# EasyEDA Pro project 3轴6.1--esp32 -(7-8).eprj, board PCB
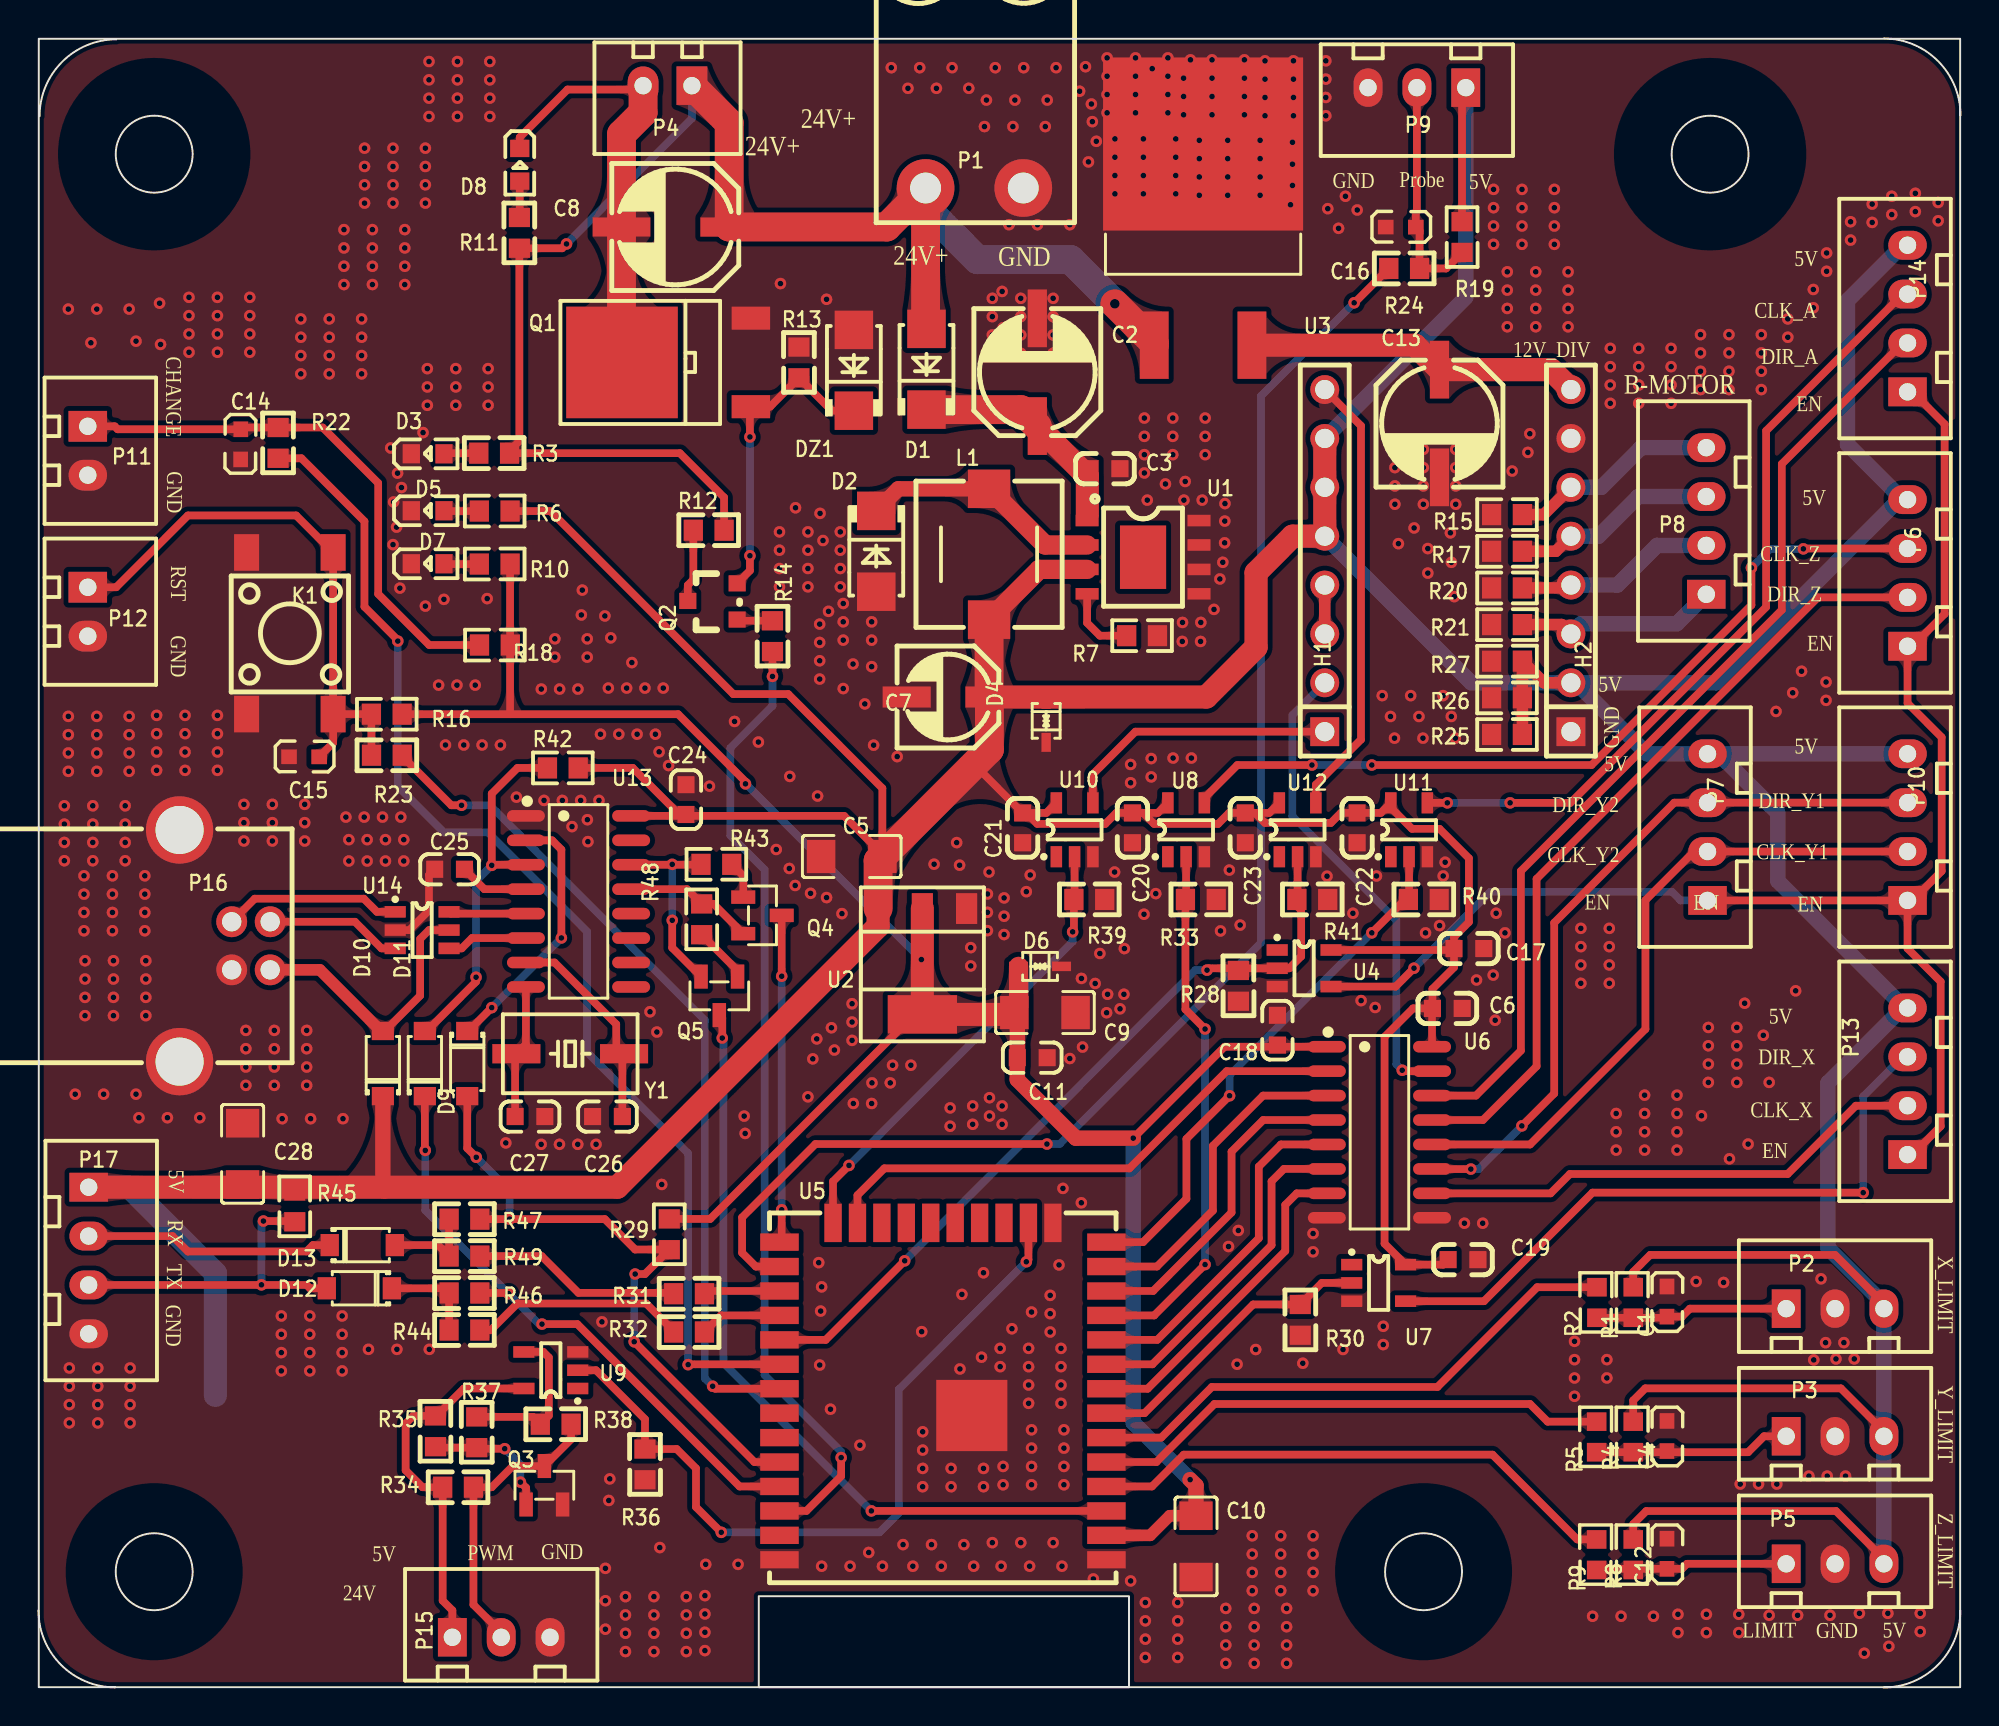
[diagram p1: board, top side]
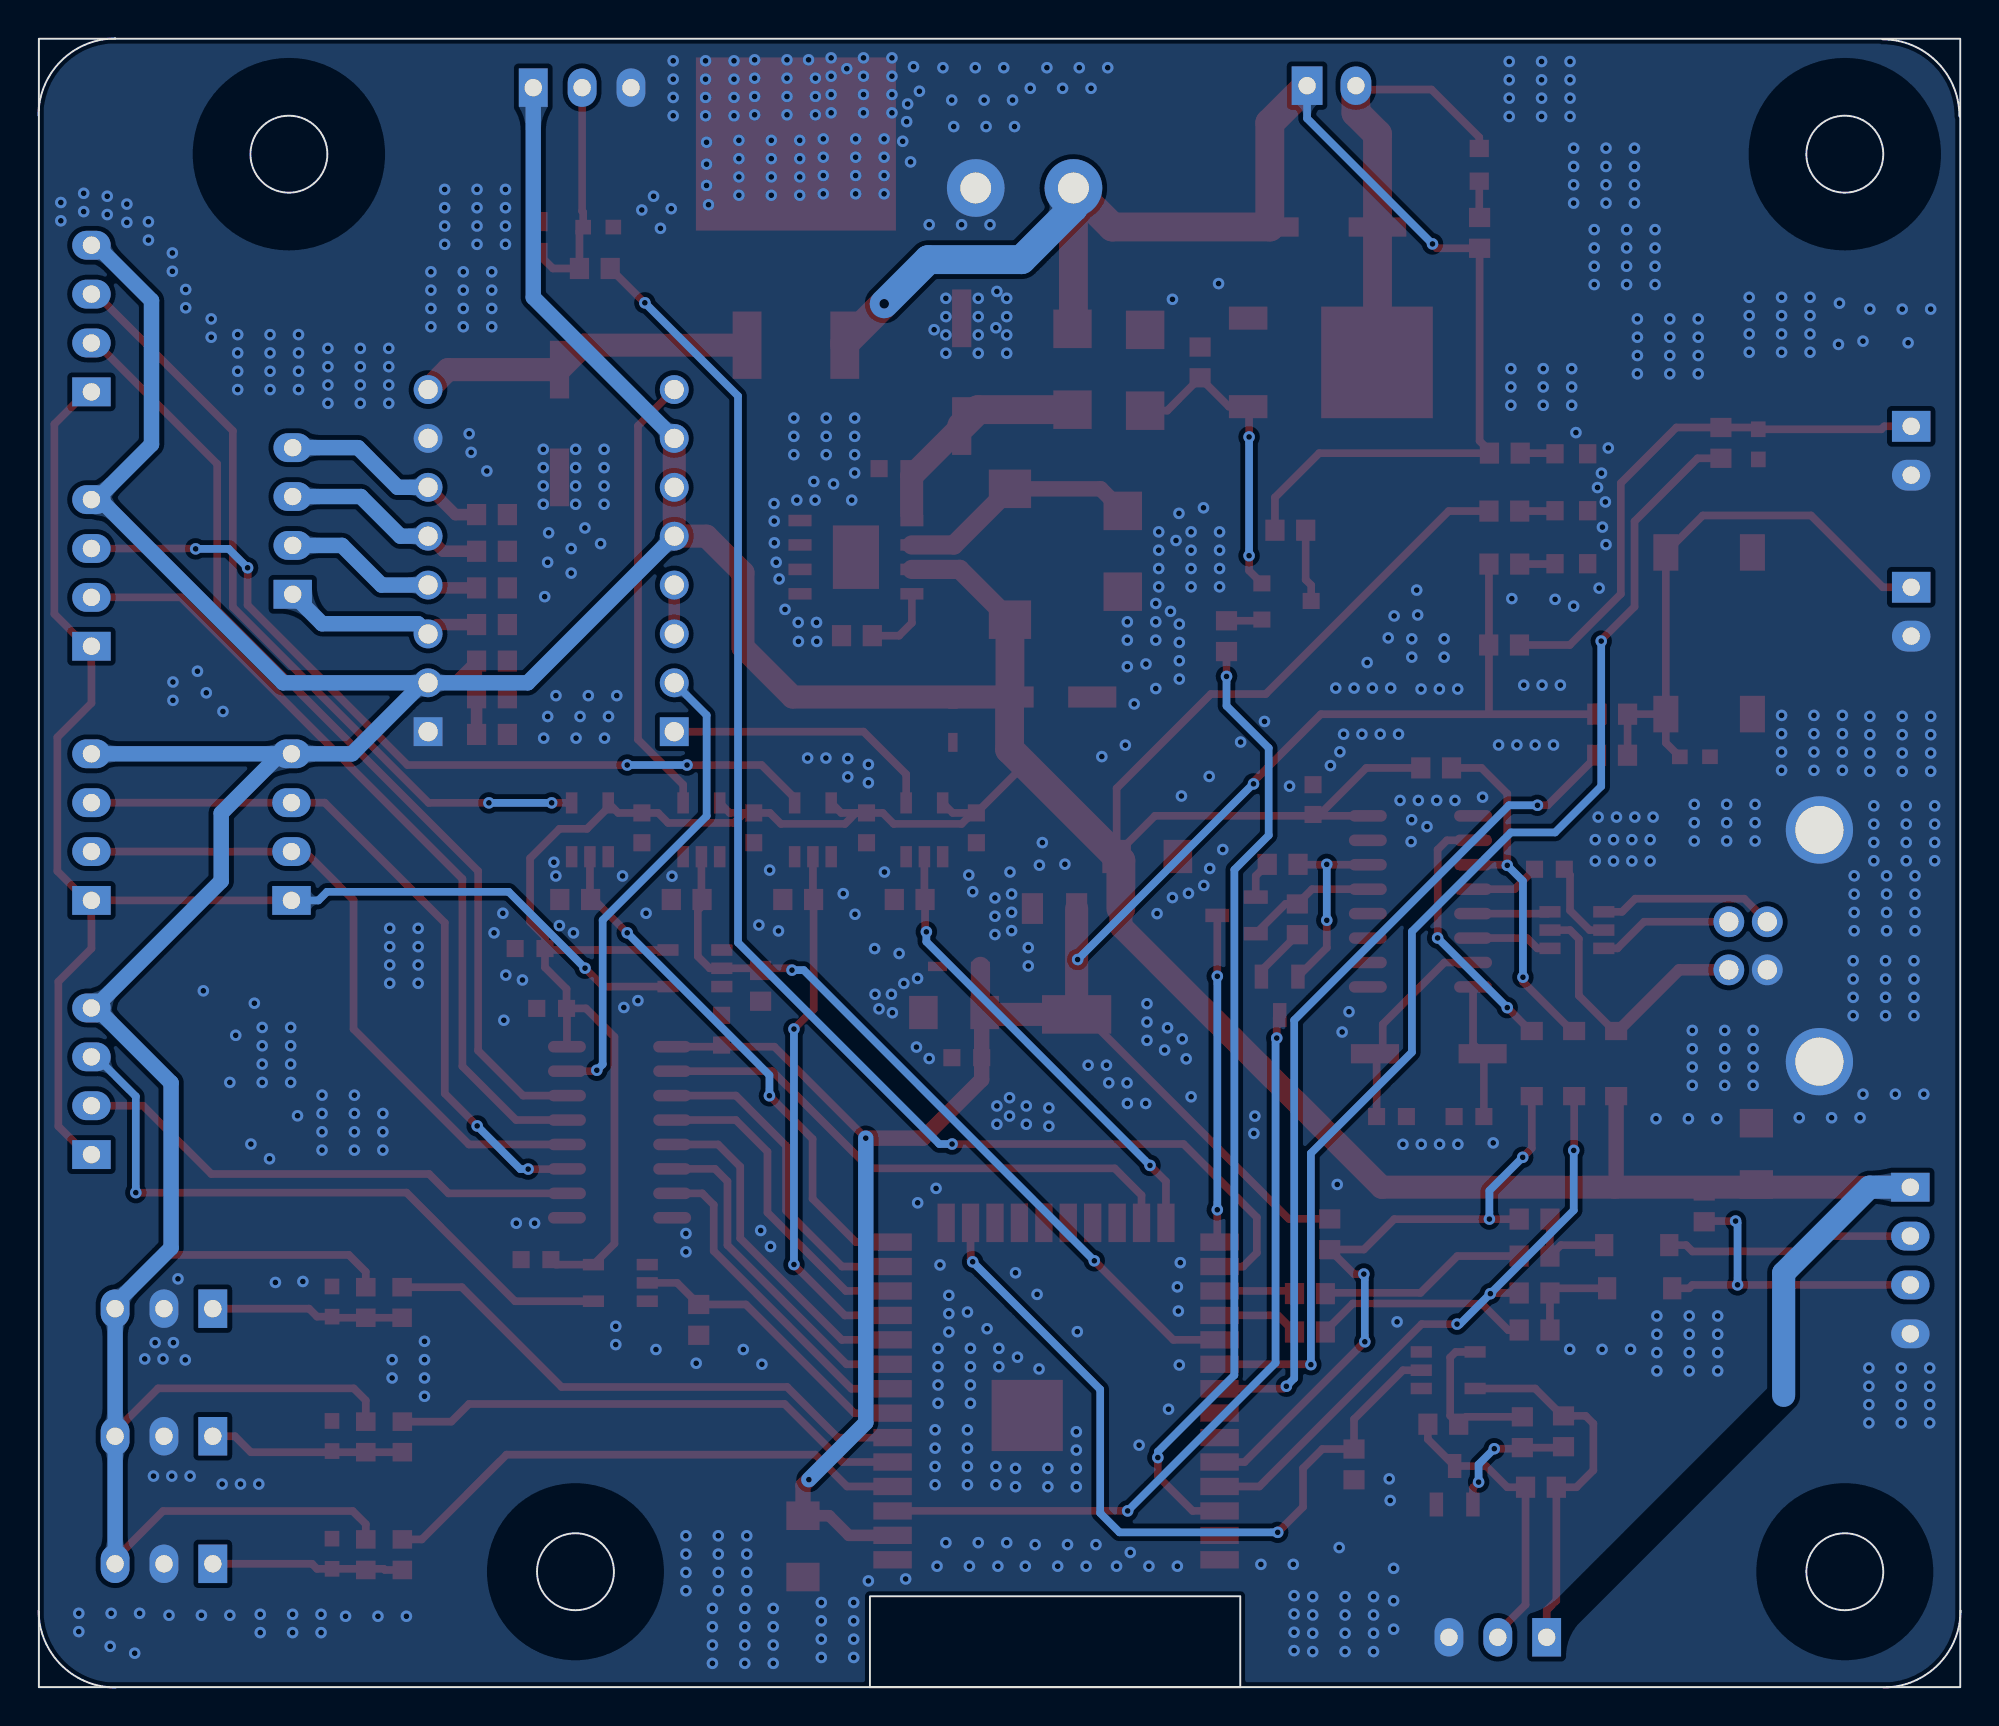
[diagram p2: board, bottom side, seen from below]

Outline 99.94 x 85.7 mm; copper layers: Top Layer, Bottom Layer. Coordinates in mm from the lower left corner of the outline.
Outline path: rectangle 0.02,85.69 99.92,0.02 ; circle c6.02,79.69 r2 ; circle c6.02,6.02 r2 ; rectangle 37.45,4.74 56.7,0.02 ; circle c72.02,6.02 r2 ; circle c86.92,79.69 r2 ; 0.06,81.66 arc(1.23,84.49) 4.06,85.66 ; 4,0.01 arc(1.17,1.18) 0,4.01 ; 95.94,85.7 arc(98.77,84.53) 99.94,81.7 ; 99.93,4 arc(98.76,1.17) 95.93,0
Stack: Top Layer 0.035mm / Dielectric1 1.51mm FR4 er 4.5 / Bottom Layer 0.035mm

## Design rules (mm)
template: 用户自定义配置
spacing Default (default): track to track 0.152, other pairs 0 to 0.152
track width Default (default): min 0.254, default 0.254, max 25.4
differential pair differentialPair (default): width min 0.127, default 0.254, max 2.54; gap min 0.152, default 0.152
via Default (default): diameter min 0.25, default 0.61, max 100.025; hole min 0.2, default 0.305, max 59.995

## Placement (name value [footprint] x y rotation side)
C1  103  [11]  84.97 20.8 90 top
C2  100uF/35V  [电解电容贴片6X6]  51.94 68.36 90 top
C3  104  [0603C]  55.45 63.34 180 top
C4  103  [11]  84.97 13.81 90 top
C5  10uF  [C1206]  42.29 43.19 180 top
C6  104  [0603C]  73.25 35.29 180 top
C7  100uF/10V  [CAP-SMD_BD5.0-L5.3-W5.3-RD]  47.3 51.48 0 top
C8  100uF/35V  [电解电容贴片6X6]  33.11 75.9 180 top
C9  4.7uF  [C1206]  52.33 35.08 180 top
C10  4.7uF  [C1206]  60.19 7.33 90 top
C11  104  [0603C]  51.67 32.73 180 top
C12  103  [11]  84.97 7.69 90 top
C13  100uF/35V(47uF/50V)  [电解电容贴片6X6]  72.85 65.69 270 top
C14  103  [11]  10.22 63.87 270 top
C15  103  [11]  13.07 48.67 180 top
C16  103  [11]  70.09 76.2 180 top
C17  104  [0603C]  74.38 38.4 180 top
C18  104  [0603C]  64.42 34.16 90 top
C19  104  [0603C]  74.07 22.24 180 top
C20  104  [0603C]  56.88 44.68 90 top
C21  104  [0603C]  51.17 44.68 90 top
C22  104  [0603C]  68.56 44.68 90 top
C23  104  [0603C]  62.75 44.68 90 top
C24  104  [0603C]  33.67 46.15 90 top
C25  104  [0603C]  21.38 42.53 180 top
C26  18pF  [0603C]  29.59 29.67 180 top
C27  18pF  [0603C]  25.56 29.67 0 top
C28  10uF  [C1206]  10.61 27.73 90 top
D1  SS56  [SMA]  46.17 68.51 90 top
D2  SS34  [SMA]  43.56 59.05 270 top
D3  绿光  [0603LED]  20.2 64.1 180 top
D4  PESD5V0L1BA-N  [SOD-323_L1.8-W1.3-LS2.5-BI]  52.39 50.24 90 top
D5  绿光  [0603LED]  20.2 61.14 180 top
D6  PESD3V3L1BA-N  [SOD-323_L1.8-W1.3-LS2.5-BI]  52.08 37.48 180 top
D7  绿光  [0603LED]  20.2 58.39 180 top
D8  绿光  [0603LED]  25.01 79.17 90 top
D9  1N4148  [SOD-123_L2.8-W1.8-LS3.7-RD]  22.29 32.43 270 top
D10  1N4148  [SOD-123_L2.8-W1.8-LS3.7-RD]  17.91 32.43 90 top
D11  1N4148  [SOD-123_L2.8-W1.8-LS3.7-RD]  20.09 32.43 90 top
D12  1N4148  [SOD-123_L2.8-W1.8-LS3.7-RD]  16.68 20.75 180 top
D13  1N4148  [SOD-123_L2.8-W1.8-LS3.7-RD]  16.84 22.99 0 top
DZ1  --ѹ------SMAZ10V  [SMA]  42.4 68.46 90 top
H1  PZ254V-11-08P  [HDR-TH_8P-P2.54-V-M]  66.88 58.57 90 top
H2  PZ254V-11-08P  [HDR-TH_8P-P2.54-V-M]  79.68 58.57 90 top
K1  SW_6X6_H=12.0MM  [KEY-SMD_4P-L6.0-W6.0-P4.50-LS9.0]  13.07 54.79 90 top
L1  68uH  [IND-SMD_L7.0-W7.0_SMDRI74-330MT]  49.43 58.9 90 top
P1  WJ2EDGR-5.08-2P  [CONN-TH_WJ2EDGR-5.08-2P]  48.67 77.93 180 top
P2  3P  [HDR1X3_CON]  93.41 19.69 0 top
P3  3P  [HDR1X3_CON]  93.41 13.06 0 top
P4  2P  [HDR1X2_CON]  32.71 83.25 180 top
P5  3P  [HDR1X3_CON]  93.41 6.43 0 top
P6  4P  [HDR1X4_CON]  97.18 54.11 90 top
P7  4P  [HDR1X4_CON]  86.78 40.91 90 top
P8  4P  [HDR1X4_CON]  86.72 56.82 90 top
P9  3P  [HDR1X3_CON]  71.67 83.15 180 top
P10  4P  [HDR1X4_CON]  97.18 40.91 90 top
P11  2P  [HDR1X2_CON]  2.57 64.28 270 top
P12  2P  [HDR1X2_CON]  2.57 55.91 270 top
P13  4P  [HDR1X4_CON]  97.18 27.7 90 top
P14  4P  [HDR1X4_CON]  97.18 67.34 90 top
P15  3P  [HDR1X3_CON]  24.06 2.61 0 top
P16  USB-B10-BRW  [USB-B-TH_USB-B10-BRW]  9.69 38.55 270 top
P17  4P  [HDR1X4_CON]  2.61 26 270 top
Q1  F50N06 (FR9024N)  [TO-252]  34.44 68.87 90 top
Q2  SS8050  [SOT-23]  36.33 55.5 90 top
Q3  SS8050  [SOT-23-3_L2.9-W1.3-P1.90-LS2.4-BR]  26.3 10.51 270 top
Q4  SS8050  [SOT-23-3_L2.9-W1.3-P1.90-LS2.4-BR]  37.64 40.13 180 top
Q5  SS8050  [SOT-23-3_L2.9-W1.3-P1.90-LS2.4-BR]  35.4 35.95 90 top
R1  20K  [10]  83.04 19.12 90 top
R2  100  [10]  81.15 19.12 90 top
R3  47K  [0603R]  23.69 64.15 0 top
R4  20K  [10]  83.04 12.13 90 top
R5  100  [10]  81.14 12.13 90 top
R6  10K  [0603R]  23.72 61.14 0 top
R7  10K  [0603R]  57.38 54.66 0 top
R8  20K  [10]  83.04 6.01 90 top
R9  100  [10]  81.14 6.01 90 top
R10  10K  [0603R]  23.72 58.39 0 top
R11  100K  [0603R]  25.01 75.6 90 top
R12  50K  [0603R]  34.85 60.14 0 top
R13  10K  [0603R]  39.54 68.87 270 top
R14  2K  [0603R]  38.17 54.64 270 top
R15  10K  [0603R]  76.36 60.96 180 top
R16  10K  [0603R]  18.11 50.58 180 top
R17  10K  [0603R]  76.36 59.05 180 top
R18  10K  [0603R]  23.73 54.18 180 top
R19  10K  [0603R]  74.02 75.38 270 top
R20  10K  [0603R]  76.36 57.15 180 top
R21  10K  [0603R]  76.36 55.24 180 top
R22  100  [0603R]  12.46 64.68 90 top
R23  100  [0603R]  18.12 48.45 180 top
R24  100  [0603R]  71.01 73.75 0 top
R25  10K  [0603R]  76.36 49.53 180 top
R26  10K  [0603R]  76.36 51.44 180 top
R27  10K  [0603R]  76.36 53.34 180 top
R28  10K  [0603R]  62.39 36.47 270 top
R29  10K  [0603R]  32.8 23.55 270 top
R30  10K  [0603R]  65.61 19.11 270 top
R31  0Ω  [0603R]  33.83 20.47 180 top
R32  0Ω  [0603R]  33.83 18.48 180 top
R33  10K  [0603R]  60.44 40.95 0 top
R34  10K  [0603R]  21.82 10.41 180 top
R35  10K  [0603R]  20.64 13.32 90 top
R36  10K  [0603R]  31.54 11.59 270 top
R37  1K  [0603R]  22.79 13.27 270 top
R38  0Ω  [0603R]  26.89 13.69 180 top
R39  10K  [0603R]  54.64 40.95 0 top
R40  10K  [0603R]  72.03 40.95 0 top
R41  10K  [0603R]  66.23 40.95 0 top
R42  10K  [0603R]  27.27 47.79 0 top
R43  10K  [0603R]  35.25 42.78 0 top
R44  0Ω  [0603R]  22.15 18.58 0 top
R45  10K  [0603R]  13.33 25 90 top
R46  0Ω  [0603R]  22.15 20.5 180 top
R47  0Ω  [0603R]  22.15 24.34 180 top
R48  10K  [0603R]  34.48 39.92 270 top
R49  0Ω  [0603R]  22.15 22.42 180 top
U1  XL1509-5.0E1//SXL1509-5.0E1  [ESOP-8_L4.9-W3.9-P1.27-LS6.0-BL-EP]  57.43 58.74 270 top
U2  1117-3.3  [SOT-223]  45.96 37.78 180 top
U3  CJ7812  [TO-263-2_L10.1-W9.1-P5.08-LS15.2-TL]  60.55 74.99 90 top
U4  74LVC1G04  [SOT-23-5]  65.81 37.38 0 top
U5  ESP32-WROOM-32  [WIFI-SMD_ESP32-WROOM-32UE-A]  47.03 15.39 180 top
U6  CA-IS3760  [SOIC-16_L9.9-W3.9-P1.27-LS6.0-BL]  69.72 28.86 270 top
U7  74LVC1G17  [SOT-23-5]  69.68 21.03 0 top
U8  74LVC1G17  [SOT-23-5]  59.67 44.58 90 top
U9  74LVC1G04  [SOT-23-5]  26.64 16.49 180 top
U10  74LVC1G17  [SOT-23-5]  53.87 44.58 90 top
U11  74LVC1G17  [SOT-23-5]  71.27 44.58 90 top
U12  74LVC1G17  [SOT-23-5]  65.47 44.58 90 top
U13  CH340G  [SOIC-16_L9.9-W3.9-P1.27-LS6.0-BL]  28.08 40.85 270 top
U14  USBLC2-2SC6  [SOT-23-6]  19.95 39.36 0 top
Y1  12M  [晶振贴片49SSMD]  27.65 32.94 0 top

## Footprints (pads in the part's own frame, mm; a bottom-side part is the same pattern mirrored in y, then rotated)
10
  rect 0.965x1.016 smd: 1(0.101,0.117) 2(1.688,0.117)
11
  rect 0.813x0.762 smd: 1(0.043,0.296) 2(-1.524,0.301)
0603C
  rect 0.889x0.889 smd: 1(-0.774,0) 2(0.774,0)
0603LED
  rect 0.9x1 smd: 1(-0.884,-0.017) 2(0.816,-0.017)
0603R
  rect 1x1.1 smd: 1(-0.8,0) 2(0.8,0)
C1206
  rect 1.485x1.728 smd: 1(-1.593,0) 2(1.593,0)
CAP-SMD_BD5.0-L5.3-W5.3-RD
  rect 2.5x1.1 smd: 1(2.15,0) 2(-2.15,0)
CONN-TH_WJ2EDGR-5.08-2P
  round 3 hole 1.6: 1(-2.54,0) 2(2.54,0)
ESOP-8_L4.9-W3.9-P1.27-LS6.0-BL-EP
  rect 0.6x1.2 smd: 1(-1.905,-2.909) 2(-0.635,-2.909) 3(0.635,-2.909) 4(1.905,-2.909) 5(1.905,2.909) 6(0.635,2.909) 7(-0.635,2.909) 8(-1.905,2.909)
  rect 3.3x2.4 smd: 9(0,0)
HDR1X2_CON
  rect 1.6x2 hole 0.9: 1(-1.27,0)
  oval 1.6x2 hole 0.9: 2(1.27,0)
HDR1X3_CON
  rect 1.5x2 hole 0.9: 1(-2.54,0)
  oval 1.5x2 hole 0.9: 2(0,0) 3(2.54,0)
HDR1X4_CON
  rect 1.5x2 hole 0.9: 1(0,0)
  oval 1.5x2 hole 0.9: 2(2.54,0) 3(5.08,0) 4(7.62,0)
HDR-TH_8P-P2.54-V-M
  rect 1.5x1.5 hole 1: 1(-8.89,0)
  round 1.5 hole 1: 2(-6.35,0) 3(-3.81,0) 4(-1.27,0) 5(1.27,0) 6(3.81,0) 7(6.35,0) 8(8.89,0)
IND-SMD_L7.0-W7.0_SMDRI74-330MT
  rect 2x2.2 smd: 1(-3.4,0) 2(3.4,0)
KEY-SMD_4P-L6.0-W6.0-P4.50-LS9.0
  rect 1.9x1.3 smd: 1(-4.2,2.25) 2(4.2,2.25) 3(-4.2,-2.25) 4(4.2,-2.25)
SMA
  rect 2x2 smd: 1(2.1,0) 2(-2.1,0)
SOD-123_L2.8-W1.8-LS3.7-RD
  rect 0.95x1.15 smd: 1(-1.692,0) 2(1.692,0)
SOD-323_L1.8-W1.3-LS2.5-BI
  rect 0.986x0.49 smd: 1(-1.117,0) 2(1.117,0)
SOIC-16_L9.9-W3.9-P1.27-LS6.0-BL
  oval 0.602x1.971 smd: 1(-4.445,-2.736) 2(-3.175,-2.736) 3(-1.905,-2.736) 4(-0.635,-2.736) 5(0.635,-2.736) 6(1.905,-2.736) 7(3.175,-2.736) 8(4.445,-2.736) 9(4.445,2.736) 10(3.175,2.736) 11(1.905,2.736) 12(0.635,2.736) 13(-0.635,2.736) 14(-1.905,2.736) 15(-3.175,2.736) 16(-4.445,2.736)
SOT-23
  rect 0.838x0.889 smd: 1(0,0) 2(1.879,0) 3(0.965,2.566)
SOT-23-3_L2.9-W1.3-P1.90-LS2.4-BR
  rect 1.25x0.7 smd: 1(1,-0.95) 2(1,0.95) 3(-1,0)
SOT-23-5
  rect 1.1x0.6 smd: 1(-1.4,0.95) 2(-1.4,0) 3(-1.4,-0.95) 4(1.4,-0.95) 5(1.4,0.95)
SOT-23-6
  rect 1.1x0.6 smd: 1(-1.4,0.95) 2(-1.4,0) 3(-1.4,-0.95) 4(1.4,-0.95) 5(1.4,0) 6(1.4,0.95)
SOT-223
  rect 1.1x1.6 smd: 1(-2.3,-2.7) 2(0,-2.7) 3(2.3,-2.7)
  rect 3.6x2 smd: 4(0,2.8)
TO-252
  rect 1.2x2 smd: 1(-2.3,-2.6) 3(2.3,-2.6)
  rect 5.8x5.8 smd: 2(0,4.1)
TO-263-2_L10.1-W9.1-P5.08-LS15.2-TL
  rect 3.5x1.5 smd: 1(-5.228,2.54) 3(-5.228,-2.54)
  rect 9x10.4 smd: 2(5.228,0)
USB-B-TH_USB-B10-BRW
  round 1.6 hole 1: 1(1.25,2.355) 2(-1.25,2.355) 3(-1.25,0.355) 4(1.25,0.355)
  round 3.5 hole 2.5: 5(-6.02,-2.355) 6(6.02,-2.355)
WIFI-SMD_ESP32-WROOM-32UE-A
  rect 2x0.9 smd: 1(-8.5,8.755) 2(-8.5,7.485) 3(-8.5,6.215) 4(-8.5,4.945) 5(-8.5,3.675) 6(-8.5,2.405) 7(-8.5,1.135) 8(-8.5,-0.135) 9(-8.5,-1.405) 10(-8.5,-2.675) 11(-8.5,-3.945) 12(-8.5,-5.215) 13(-8.5,-6.485) 14(-8.5,-7.755) 25(8.5,-7.755) 26(8.5,-6.485) 27(8.5,-5.215) 28(8.5,-3.945) 29(8.5,-2.675) 30(8.5,-1.405) 31(8.5,-0.135) 32(8.5,1.135) 33(8.5,2.405) 34(8.5,3.675) 35(8.5,4.945) 36(8.5,6.215) 37(8.5,7.485) 38(8.5,8.755)
  rect 0.9x2 smd: 15(-5.715,-8.755) 16(-4.445,-8.755) 17(-3.175,-8.755) 18(-1.905,-8.755) 19(-0.635,-8.755) 20(0.635,-8.755) 21(1.905,-8.755) 22(3.175,-8.755) 23(4.445,-8.755) 24(5.715,-8.755)
  rect 3.7x3.7 smd: 39(-1.5,1.255)
晶振贴片49SSMD
  rect 2.5x1 smd: 1(-2.8,0) 2(2.8,0)
电解电容贴片6X6
  rect 3x1 smd: 1(-2.8,0) 2(2.8,0)

## Nets
As in the schematic, except:
ESP_RST: Q5.3 U5.3
REST: R23.1 U5.31

Pads without a net: U1 9; U4 1; U5 17 18 19 20 21 22 32; U7 1; U8 1; U9 1; U10 1; U11 1; U12 1; U13 9 10 11 12 15

## Via types
v1: diameter 0.6, hole 0.3, Top Layer to Bottom Layer, 875 vias
v2: diameter 0.8, hole 0.5, Top Layer to Bottom Layer, 1 via

## Routing (per net, layer and track width the routed paths; a pad name or vN(x,y) marks a point on that pad's centre or on a via; arc(x,y) is an arc through that point)
3V3: length 119.1
  Top Layer w0.4: R10.2 24.52,50.59 24.53,50.58 ; 24.53,50.58 33.26,50.58 36.76,47.08 v1(36.76,46.96) ; 24.53,50.58 R16.1 ; U6.1 61.67,33.3 v1(56.92,28.55) ; R29.1 34.93,24.35 45.56,34.98 U2.4
  Top Layer w0.6: U5.2 57.8,7.91 58.82,8.93 60.19,8.93
  Top Layer w0.8: v1(56.92,28.55) 53.93,28.55 50.89,31.59 C11.2 50.89,34.92 C9.2 ; v1(59.88,10.8) 60.19,10.5 60.19,8.93
  Top Layer w1: D6.2 50.96,35.3
  Top Layer w1.2: U2.2 U2.4 50.64,34.98 C9.2
  Bottom Layer w0.4: v1(45.91,37.83) 36.78,46.96 v1(36.76,46.96)
  Bottom Layer w0.8: v1(59.88,10.8) 56.92,13.76 v1(56.92,28.55)
5V_VCC: length 459.4
  Top Layer w0.4: 33.39,45.3 30.9,47.79 R42.2 ; 33.39,45.3 U13.16 ; 33.39,45.3 41.89,45.3 43.88,43.31 43.88,46.73 38.98,51.63 36.13,51.63 26.61,61.14 R6.2 ; U4.5 73.53,38.33 C17.2 ; U12.5 63.99,45.45 63.25,45.45 ; U10.5 52.4,45.45 51.36,45.45 ; C17.2 73.6,39.01 74.38,39.78 74.38,43.1 72.85,44.63 71.42,44.63 70.32,45.73 U11.5 69.79,45.45 C22.2 67.72,45.45 67.2,44.93 63.77,44.93 63.25,45.45 ; C17.2 73.6,37.43 72.48,36.3 C6.2 ; R4.2 82.92,14.92 83.55,15.55 93.72,15.55 95.95,13.31 P3.3 ; U6.16 72.46,35.27 C6.2 ; R19.1 74.02,82.95 P9.1 ; C6.2 71.47,35.29 69.99,33.81 69.99,23.07 U7.5 73.04,21.98 C19.2 ; 51.36,45.45 C21.2 48.83,47.79 48.77,47.79 ; 51.36,45.45 51.94,44.88 55.47,44.88 56.04,45.45 C20.2 57.43,45.45 ; R8.2 82.92,8.49 83.6,9.17 93.46,9.17 95.95,6.68 P5.3 ; 63.25,45.45 C23.2 61.9,45.45 61.33,44.88 58.01,44.88 57.43,45.45 ; P15.1 21.52,4.01 21.02,4.51 R34.2 19.97,10.41 19.09,11.29 19.09,13.72 19.49,14.12 R35.2 20.69,14.12 22.12,15.54 U9.5 ; 57.43,45.45 58.2,45.45 U8.5 ; R1.2 82.92,21.6 83.8,22.48 93.41,22.48 95.95,19.94 P2.3
  Top Layer w0.6: H2.2 78.28,52.22 R27.1 R26.1 R25.1
  Top Layer w0.8: D10.1 17.91,26.08 17.99,26
  Top Layer w1: L1.1 52.04,58.11 U1.3
  Top Layer w1.2: P17.1 30.1,26 43.66,39.56 U2.3 ; C7.1 60.72,51.48 63.31,54.06 63.31,57.94 65.21,59.84 H1.5 H1.6 H1.7
  Top Layer w1.5: U2.3 43.66,42.97 C5.1 49.45,48.75 C7.1 49.43,51.5 L1.1
  Bottom Layer w0.8: 96.93,61.73 96.74,61.73 87.22,52.22 79.95,52.22 83.64,48.53 87.35,48.53 ; 96.93,61.73 94.06,64.61 94.06,72.08 96.93,74.96 P14.4 ; 96.93,61.73 P6.4 ; 87.35,48.53 90.43,45.44 90.43,41.92 97.04,35.32 ; 87.35,48.53 97.18,48.53 ; H1.7 74.21,72.25 P9.1 ; P13.4 97.04,35.32 ; 97.04,35.32 96.93,35.32 93.04,31.43 93.04,22.85 95.95,19.94 P2.3 P3.3 P5.3 ; H2.2 74.5,52.22 H1.5
  Bottom Layer w1.2: P17.1 4.74,26 9.2,21.54 9.2,15.18 ; 21.52,2.86 P15.1
12V_DIV: length 17.5
  Top Layer w1.2: H2.8 78.65,68.49 C13.1 71.58,69.76 U3.3
24V: length 79.6
  Top Layer w0.4: v1(27.46,75.02) 27.23,74.8 R11.1 25.01,64.79 24.49,64.27 R3.2 33.35,64.15 35.65,61.85 R12.2
  Top Layer w1.5: v2(55.96,71.91) 58.02,69.86 U3.1 ; P4.1 35.91,81.31 C8.1 44.1,75.9 45.44,77.25 ; D1.1 46.13,70.66 P1.2
  Bottom Layer w0.4: P4.1 33.98,81.54 v1(27.46,75.02)
  Bottom Layer w1.5: v2(55.96,71.91) 53.67,74.21 48.83,74.21 46.13,76.91 P1.2
GND: length 4.4
  Top Layer w0.4: C25.2 20.3,42.23 20.3,40.38 19.28,39.36 U14.2
  vias: v1(1.35,45.82) v1(1.35,44.87) v1(1.35,43.92) v1(1.35,42.97) v1(1.55,71.64) v1(1.55,50.47) v1(1.55,49.52) v1(1.55,48.57) v1(1.55,47.61) v1(1.6,16.61) v1(1.6,15.65) v1(1.6,14.7) v1(1.6,13.75) v1(1.91,30.84) v1(2.37,42.19) v1(2.37,41.23) v1(2.37,40.28) v1(2.37,39.33) v1(2.42,37.77) v1(2.42,36.82) v1(2.42,35.87) v1(2.42,34.92) v1(2.73,69.89) v1(2.83,45.82) v1(2.83,44.87) v1(2.83,43.92) v1(2.83,42.97) v1(3.03,71.64) v1(3.03,50.47) v1(3.03,49.52) v1(3.03,48.57) v1(3.03,47.61) v1(3.08,16.61) v1(3.08,15.65) v1(3.08,14.7) v1(3.08,13.75) v1(3.39,30.84) v1(3.85,42.19) v1(3.85,41.23) v1(3.85,40.28) v1(3.85,39.33) v1(3.9,37.77) v1(3.9,36.82) v1(3.9,35.87) v1(3.9,34.92) v1(4.51,45.82) v1(4.51,44.87) v1(4.51,43.92) v1(4.51,42.97) v1(4.72,71.64) v1(4.72,50.47) v1(4.72,49.52) v1(4.72,48.57) v1(4.72,47.61) v1(4.77,16.61) v1(4.77,15.65) v1(4.77,14.7) v1(4.77,13.75) v1(5.07,69.97) v1(5.07,30.84) v1(5.22,29.61) v1(5.53,42.19) v1(5.53,41.23) v1(5.53,40.28) v1(5.53,39.33) v1(5.58,37.77) v1(5.58,36.82) v1(5.58,35.87) v1(5.58,34.92) v1(6.14,50.52) v1(6.14,49.57) v1(6.14,48.62) v1(6.14,47.67) v1(6.3,71.94) v1(6.35,69.8) v1(6.7,29.61) v1(7.62,50.52) v1(7.62,49.57) v1(7.62,48.62) v1(7.62,47.67) v1(7.83,72.25) v1(7.83,71.3) v1(7.83,70.34) v1(7.83,69.39) v1(8.39,29.61) v1(9.31,72.25) v1(9.31,71.3) v1(9.31,70.34) v1(9.31,69.39) v1(9.31,50.52) v1(9.31,49.57) v1(9.31,48.62) v1(9.31,47.67) v1(10.68,45.9) v1(10.68,44.95) v1(10.68,43.99) v1(10.78,34.15) v1(10.78,33.2) v1(10.78,32.25) v1(10.78,31.3) v1(10.99,72.25) v1(10.99,71.3) v1(10.99,70.34) v1(10.99,69.39) v1(12.16,45.9) v1(12.16,44.95) v1(12.16,43.99) v1(12.26,34.15) v1(12.26,33.2) v1(12.26,32.25) v1(12.26,31.3) v1(12.67,29.56) v1(12.63,19.31) v1(12.63,18.36) v1(12.63,17.41) v1(12.63,16.45) v1(13.64,71.13) v1(13.64,70.17) v1(13.64,69.22) v1(13.64,68.27) v1(13.84,45.9) v1(13.84,44.95) v1(13.84,43.99) v1(13.95,34.15) v1(13.95,33.2) v1(13.95,32.25) v1(13.95,31.3) v1(14.11,19.31) v1(14.11,18.36) v1(14.11,17.41) v1(14.11,16.45) v1(14.15,29.56) v1(15.12,71.13) v1(15.12,70.17) v1(15.12,69.22) v1(15.12,68.27) v1(15.79,19.31) v1(15.79,18.36) v1(15.79,17.41) v1(15.79,16.45) v1(15.88,75.77) v1(15.88,74.82) v1(15.88,73.86) v1(15.88,72.91) v1(15.83,29.56) v1(15.98,45.24) v1(16.14,44.06) v1(16.14,42.95) v1(16.8,71.13) v1(16.8,70.17) v1(16.8,69.22) v1(16.8,68.27) v1(16.95,80) v1(16.95,79.05) v1(16.95,78.1) v1(16.95,77.14) v1(16.94,45.24) v1(17.09,44.06) v1(17.09,42.95) v1(17.16,17.58) v1(17.36,75.77) v1(17.36,74.82) v1(17.36,73.86) v1(17.36,72.91) v1(17.89,45.24) v1(18.04,44.06) v1(18.04,42.95) v1(18.31,64.42) v1(18.43,80) v1(18.43,79.05) v1(18.43,78.1) v1(18.43,77.14) v1(18.47,61.61) v1(18.43,59.4) v1(18.67,63.11) v1(18.62,60.31) v1(18.64,17.58) v1(18.79,57.14) v1(18.88,62.36) v1(18.84,45.24) v1(18.99,44.06) v1(18.99,42.95) v1(19.05,75.77) v1(19.05,74.82) v1(19.05,73.86) v1(19.05,72.91) v1(20,65.22) v1(20.12,80) v1(20.12,79.05) v1(20.12,78.1) v1(20.12,77.14) v1(20.12,56.2) v1(20.31,84.5) v1(20.31,83.55) v1(20.31,82.6) v1(20.31,81.65) v1(20.22,68.54) v1(20.22,67.59) v1(20.22,66.64) v1(20.32,17.58) v1(20.81,52.09) v1(21.08,56.55) v1(21.16,48.98) v1(21.7,68.54) v1(21.7,67.59) v1(21.7,66.64) v1(21.78,84.5) v1(21.78,83.55) v1(21.78,82.6) v1(21.78,81.65) v1(21.76,52.09) v1(22.12,48.98) v1(22.71,52.09) v1(23.07,48.98) v1(23.38,68.54) v1(23.38,67.59) v1(23.38,66.64) v1(23.33,56.59) v1(23.47,84.5) v1(23.47,83.55) v1(23.47,82.6) v1(23.47,81.65) v1(24.02,48.98) v1(24.3,28.3) v1(24.85,46.27) v1(26.14,51.89) v1(26.14,28.23) v1(26.29,46.1) v1(26.85,54.5) v1(26.85,53.55) v1(27.1,51.89) v1(27.09,28.23) v1(27.24,46.1) v1(27.74,44.74) v1(28.05,51.89) v1(28.04,28.23) v1(28.19,46.1) v1(28.28,57.03) v1(28.23,55.74) v1(28.53,54.5) v1(28.53,53.55) v1(28.54,45.1) v1(28.57,43.96) v1(28.99,28.23) v1(29.14,46.1) v1(29.22,49.54) v1(29.3,19) v1(29.45,55.69) v1(29.48,6.19) v1(29.48,4.51) v1(29.48,3.03) v1(29.63,51.94) v1(29.71,10.84) v1(29.65,9.72) v1(29.76,54.55) v1(30.17,49.54) v1(30.58,51.94) v1(30.52,4.72) v1(30.52,3.77) v1(30.52,2.82) v1(30.52,1.87) v1(30.85,53.27) v1(31.13,49.54) v1(31.53,51.94) v1(31.8,35.12) v1(32,4.72) v1(32,3.77) v1(32,2.82) v1(32,1.87) v1(32.08,49.54) v1(32.15,34.07) v1(32.27,48.63) v1(32.31,7.27) v1(32.41,26.14) v1(32.49,51.94) v1(32.76,47.91) v1(33.68,4.72) v1(33.68,3.77) v1(33.68,2.82) v1(33.68,1.87) v1(34.69,6.4) v1(34.65,4.77) v1(34.65,3.82) v1(34.65,2.87) v1(34.65,1.92) v1(34.89,46.84) v1(36.19,50.21) v1(36.38,6.4) v1(36.69,29.7) v1(36.74,28.8) v1(37.43,49.14) v1(38.36,43.55) v1(38.58,72.96) v1(38.53,60.06) v1(38.53,59.11) v1(38.53,58.16) v1(38.53,57.2) v1(39.07,47.35) v1(39.04,42.57) v1(39.36,61.31) v1(39.34,41.68) v1(40.01,60.06) v1(40.01,59.11) v1(40.01,58.16) v1(40.01,57.2) v1(40.01,30.7) v1(40.14,41.27) v1(40.26,32.67) v1(40.51,46.33) v1(40.47,33.71) v1(40.57,22.08) v1(40.64,61.02) v1(40.62,55.27) v1(40.62,54.31) v1(40.62,53.36) v1(40.62,52.41) v1(40.67,19.56) v1(40.62,16.76) v1(40.79,59.61) v1(40.72,20.82) v1(40.72,6.3) v1(40.98,72.15) v1(40.98,41.05) v1(41.08,55.93) v1(41.18,14.46) v1(41.23,34.29) v1(41.38,33.13) v1(41.69,60.06) v1(41.69,59.11) v1(41.69,58.16) v1(41.69,57.2) v1(41.78,40.22) v1(41.84,56.34) v1(41.84,55.38) v1(41.84,54.43) v1(41.84,51.92) v1(42.2,6.3) v1(42.3,35.54) v1(42.3,34.58) v1(42.3,33.63) v1(42.35,53.19) v1(42.37,30.35) v1(42.71,12.59) v1(42.97,51.12) v1(43.17,7.02) v1(43.32,55.38) v1(43.32,54.43) v1(43.32,53.06) v1(43.34,31.42) v1(43.32,30.35) v1(43.42,48.97) v1(43.88,6.3) v1(44.29,31.42) v1(44.34,84.18) v1(44.41,32.34) v1(44.65,48.38) v1(44.95,7.43) v1(45.21,83.11) v1(45.36,32.34) v1(45.46,6.3) v1(45.82,84.18) v1(45.92,18.49) v1(45.97,13.29) v1(45.97,12.34) v1(45.97,11.39) v1(45.97,10.44) v1(46.43,7.43) v1(46.57,42.79) v1(46.69,83.11) v1(46.94,6.3) v1(47.4,30.12) v1(47.4,29.17) v1(47.5,84.18) v1(47.45,11.39) v1(47.45,10.44) v1(47.74,43.91) v1(47.89,42.74) v1(47.91,16.56) v1(48.01,20.43) v1(48.12,7.43) v1(48.37,83.11) v1(48.47,38.45) v1(48.47,37.5) v1(48.58,30.22) v1(48.58,29.27) v1(48.63,6.3) v1(49.03,17.17) v1(49.19,81.12) v1(49.14,21.55) v1(49.14,11.39) v1(49.14,10.44) v1(49.29,82.5) v1(49.34,41.24) v1(49.34,40.29) v1(49.34,39.34) v1(49.42,42.38) v1(49.45,30.65) v1(49.45,29.7) v1(49.6,72.2) v1(49.6,71.25) v1(49.6,70.29) v1(49.6,69.34) v1(49.6,7.53) v1(49.75,84.18) v1(50,17.63) v1(50,16.67) v1(50.11,72.55) v1(50.11,30.22) v1(50.11,29.27) v1(50.05,6.3) v1(50.16,70.67) v1(50.21,41.04) v1(50.21,40.08) v1(50.21,39.13) v1(50.16,11.49) v1(50.16,10.54) v1(50.46,76.02) v1(50.67,81.12) v1(50.62,18.65) v1(50.77,82.5) v1(51.07,72.2) v1(51.07,71.25) v1(51.07,70.29) v1(51.07,69.34) v1(51.07,7.53) v1(51.23,84.18) v1(51.36,41.36) v1(51.48,17.63) v1(51.48,16.67) v1(51.48,15.72) v1(51.48,14.77) v1(51.57,42.23) v1(51.53,6.3) v1(51.64,19.51) v1(51.64,13.39) v1(51.64,12.44) v1(51.64,11.49) v1(51.64,10.54) v1(51.94,76.02) v1(52.35,81.12) v1(52.45,82.5) v1(52.6,20.38) v1(52.6,19.43) v1(52.6,18.48) v1(52.76,72.2) v1(52.76,71.25) v1(52.76,70.29) v1(52.76,69.34) v1(52.76,7.53) v1(52.91,84.18) v1(53.06,21.96) v1(53.17,17.63) v1(53.17,16.67) v1(53.17,15.72) v1(53.17,14.77) v1(53.27,25.94) v1(53.22,6.3) v1(53.37,70.57) v1(53.32,13.39) v1(53.32,12.44) v1(53.32,11.49) v1(53.32,10.54) v1(53.62,76.02) v1(53.62,32.69) v1(54.13,82.96) v1(54.23,36.85) v1(54.29,33.28) v1(54.22,25.19) v1(54.44,84.23) v1(54.59,79.29) v1(54.75,82.3) v1(54.8,81.38) v1(54.85,5.64) v1(55,80.36) v1(54.94,36.59) v1(55.19,38.15) v1(55.56,84.69) v1(55.56,83.74) v1(55.56,82.79) v1(55.56,81.84) v1(55.59,36.03) v1(55.54,35.07) v1(55.97,80.48) v1(55.97,79.53) v1(55.97,78.58) v1(55.97,77.63) v1(55.95,42.38) v1(56.24,35.27) v1(56.46,38.4) v1(56.44,36.03) v1(56.79,47.97) v1(56.79,47.02) v1(56.79,5.54) v1(57.04,84.69) v1(57.04,83.74) v1(57.04,82.79) v1(57.04,81.84) v1(57.45,80.48) v1(57.45,79.53) v1(57.45,78.58) v1(57.45,77.63) v1(57.5,65.97) v1(57.5,65.02) v1(57.5,64.07) v1(57.5,63.12) v1(57.48,40.19) v1(57.55,4.42) v1(57.55,3.47) v1(57.55,2.51) v1(57.55,1.56) v1(57.65,61.71) v1(57.91,84.13) v1(57.86,48.28) v1(57.86,47.33) v1(58.09,41.26) v1(58.6,62.55) v1(58.72,84.69) v1(58.72,83.74) v1(58.72,82.79) v1(58.72,81.84) v1(58.98,65.97) v1(58.98,65.02) v1(58.98,64.07) v1(58.99,48.3) v1(59.13,80.48) v1(59.13,79.53) v1(59.13,78.58) v1(59.13,77.63) v1(59.23,4.42) v1(59.23,3.47) v1(59.23,2.51) v1(59.23,1.56) v1(59.48,55.35) v1(59.47,54.36) v1(59.54,83.64) v1(59.54,82.69) v1(59.54,81.73) v1(59.56,61.71) v1(59.62,62.68) v1(59.9,84.59) v1(59.95,48.3) v1(60.36,80.41) v1(60.36,79.46) v1(60.36,78.5) v1(60.36,77.55) v1(60.51,61.71) v1(60.44,55.35) v1(60.42,54.36) v1(60.66,65.97) v1(60.66,65.02) v1(60.66,64.07) v1(61.02,84.59) v1(61.02,83.64) v1(61.02,82.69) v1(61.02,81.73) v1(61.12,56.03) v1(61.43,57.61) v1(61.46,39.32) v1(61.58,58.48) v1(61.69,61.53) v1(61.68,60.62) v1(61.67,59.49) v1(61.73,4.11) v1(61.73,3.16) v1(61.73,2.21) v1(61.73,1.26) v1(61.84,80.41) v1(61.84,79.46) v1(61.84,78.5) v1(61.84,77.55) v1(61.88,22.92) v1(61.92,42.48) v1(62.39,23.75) v1(62.32,16.8) v1(62.48,39.63) v1(62.7,84.59) v1(62.7,83.64) v1(62.7,82.69) v1(62.7,81.73) v1(63.11,7.89) v1(63.11,6.93) v1(63.11,5.98) v1(63.11,5.03) v1(63.21,4.11) v1(63.21,3.16) v1(63.21,2.21) v1(63.21,1.26) v1(63.29,17.57) v1(63.52,80.41) v1(63.52,79.46) v1(63.52,78.5) v1(63.52,77.55) v1(63.77,84.54) v1(63.77,83.59) v1(63.77,82.64) v1(63.77,81.68) v1(64.59,7.89) v1(64.59,6.93) v1(64.59,5.98) v1(64.59,5.03) v1(64.9,4.11) v1(64.9,3.16) v1(64.9,2.21) v1(64.9,1.26) v1(65.1,77.06) v1(65.2,80.31) v1(65.2,79.17) v1(65.2,78.06) v1(65.25,84.54) v1(65.25,83.59) v1(65.25,82.64) v1(65.25,81.68) v1(65.74,16.85) v1(66.27,23.59) v1(66.27,22.64) v1(66.27,7.89) v1(66.27,6.93) v1(66.27,5.98) v1(66.27,5.03) v1(66.94,84.54) v1(66.94,83.59) v1(66.94,82.64) v1(66.94,81.68) v1(67,42.17) v1(67.04,76.86) v1(67.6,75.84) v1(67.83,17.57) v1(67.96,77.5) v1(68.35,40.24) v1(68.57,76.79) v1(68.77,35.7) v1(69.5,35.34) v1(69.57,42.18) v1(69.87,51.55) v1(69.92,18.77) v1(69.92,17.82) v1(70.3,50.46) v1(70.51,49.34) v1(70.53,64.35) v1(70.53,63.4) v1(70.53,62.45) v1(70.53,61.49) v1(70.71,59.45) v1(71.35,51.55) v1(71.53,60.26) v1(71.78,50.46) v1(72.01,64.35) v1(72.01,63.4) v1(72.01,62.45) v1(72.01,61.49) v1(71.99,49.34) v1(72.12,39.22) v1(72.24,59.19) v1(72.24,57.92) v1(72.85,39.6) v1(73.03,51.55) v1(73.04,42.18) v1(73.14,42.89) v1(73.41,60.01) v1(73.46,58.48) v1(73.46,50.46) v1(73.69,64.35) v1(73.69,63.4) v1(73.69,62.45) v1(73.69,61.49) v1(73.62,56.69) v1(73.67,49.34) v1(74.14,24.13) v1(74.77,36.77) v1(75.09,24.13) v1(75.66,77.86) v1(75.66,76.91) v1(75.66,75.95) v1(75.66,75) v1(75.64,37.03) v1(75.79,40.24) v1(75.74,34.68) v1(76.25,39.22) v1(76.37,73.57) v1(76.37,72.62) v1(76.37,71.67) v1(76.37,70.72) v1(76.63,63.22) v1(77.14,77.86) v1(77.14,76.91) v1(77.14,75.95) v1(77.14,75) v1(77.44,64.19) v1(77.54,65.16) v1(77.85,73.57) v1(77.85,72.62) v1(77.85,71.67) v1(77.85,70.72) v1(78.82,77.86) v1(78.82,76.91) v1(78.82,75.95) v1(78.82,75) v1(79.53,73.57) v1(79.53,72.62) v1(79.53,71.67) v1(79.53,70.72) v1(79.87,17.99) v1(79.87,17.04) v1(79.87,16.09) v1(79.87,15.14) v1(80.2,39.45) v1(80.2,38.5) v1(80.2,37.55) v1(80.2,36.6) v1(80.81,3.7) v1(81.55,17.04) v1(81.55,16.09) v1(81.67,39.45) v1(81.67,38.5) v1(81.67,37.55) v1(81.67,36.6) v1(81.73,69.6) v1(81.73,68.64) v1(81.73,67.69) v1(81.73,66.74) v1(82.03,29.83) v1(82.03,28.88) v1(82.03,27.93) v1(82.29,3.7) v1(83.2,69.6) v1(83.2,68.64) v1(83.2,67.69) v1(83.2,66.74) v1(83.51,30.78) v1(83.51,29.83) v1(83.51,28.88) v1(83.51,27.93) v1(83.97,3.7) v1(84.89,69.6) v1(84.89,68.64) v1(84.89,67.69) v1(84.89,66.74) v1(85.19,30.78) v1(85.19,29.83) v1(85.19,28.88) v1(85.19,27.93) v1(85.24,3.81) v1(85.24,2.85) v1(86.19,21.1) v1(86.42,70.31) v1(86.42,69.36) v1(86.42,68.41) v1(86.42,67.45) v1(86.47,29.71) v1(86.72,3.81) v1(86.72,2.85) v1(86.83,34.3) v1(86.83,33.35) v1(86.83,32.4) v1(86.83,31.45) v1(87.62,21.05) v1(87.9,70.31) v1(87.9,69.36) v1(87.9,68.41) v1(87.9,67.45) v1(87.92,27.48) v1(88.3,34.3) v1(88.3,33.35) v1(88.3,32.4) v1(88.3,31.45) v1(88.41,3.81) v1(88.41,2.85) v1(88.48,10.57) v1(88.71,35.56) v1(88.89,28.24) v1(89.43,10.57) v1(89.58,70.31) v1(89.58,69.36) v1(89.58,68.41) v1(89.58,67.45) v1(89.68,33.9) v1(89.99,31.45) v1(89.99,3.75) v1(90.35,50.73) v1(90.39,10.57) v1(90.96,71.13) v1(90.96,70.17) v1(91.21,51.69) v1(91.36,36.21) v1(91.47,3.75) v1(91.67,52.82) v1(92.05,10.99) v1(92.28,72.66) v1(92.28,71.7) v1(92.3,17.03) v1(92.68,21.24) v1(92.98,74.55) v1(92.98,73.6) v1(92.95,52.26) v1(92.95,51.3) v1(92.92,17.92) v1(93.01,10.99) v1(93.15,3.75) v1(93.46,17.08) v1(93.87,17.92) v1(93.96,10.99) v1(94.22,76.18) v1(94.22,75.22) v1(94.41,17.08) v1(94.68,3.86) v1(94.93,1.78) v1(95.34,77.09) v1(95.34,76.14) v1(96.16,3.86) v1(96.21,2.14) v1(96.36,77.5) v1(96.36,76.55) v1(97.59,77.65) v1(97.59,76.7) v1(97.84,3.86) v1(97.84,2.9) v1(98.78,77.18) v1(98.78,76.23)
VIN_24V: length 11.8
  Top Layer w1.2: C2.1 54.54,62.96 54.54,61
  Top Layer w1.5: D1.2 51.08,66.41 C2.1
A_DIR_O: length 41.3
  Top Layer w0.4: P14.3 96.93,72.42 89.83,65.31 89.83,56.15 79.65,45.98 v1(76.52,45.98) ; U11.4 v1(73.25,45.98)
  Bottom Layer w0.4: v1(73.25,45.98) v1(76.52,45.98)
A_STEP_O: length 50.8
  Top Layer w0.4: P14.2 96.93,69.88 90.65,63.59 90.65,56 77.08,42.43 77.08,33.1 74.74,30.76 U6.14
B_1A: length 10.5
  Top Layer w0.6: R20.1 79.53,57.15 H2.4
  Bottom Layer w0.8: P8.2 84.16,59.36 82.1,57.3 H2.4
B_1B: length 10.6
  Top Layer w0.6: R21.1 79.2,55.24 H2.3
  Bottom Layer w0.8: H2.3 80.21,55.29 85.19,55.29 P8.1
B_2A: length 10.7
  Top Layer w0.6: H2.5 78.9,59.05 R17.1
  Bottom Layer w0.8: P8.3 83.18,61.9 81.12,59.84 H2.5
B_2B: length 11
  Top Layer w0.6: R15.1 78.26,60.96 H2.6
  Bottom Layer w0.8: P8.4 83.32,64.44 81.26,62.38 H2.6
B_DIR_O: length 14.5
  Top Layer w0.4: H1.1 57.04,49.68 54.82,47.46 U10.4
B_STEP_O: length 24.8
  Top Layer w0.4: U6.15 70.96,32.03 v1(70.91,32.08)
  Bottom Layer w0.4: H1.2 65.2,50.53 65.2,45.29 70.6,39.88 70.6,32.39 v1(70.91,32.08)
CHANGE: length 62.7
  Top Layer w0.4: U5.30 33.8,16.8 v1(33.78,16.78) ; v1(18.68,54.38) 18.68,54.43 16.95,56.17 16.95,60.61 13.67,63.88 R22.1
  Bottom Layer w0.4: v1(18.68,54.38) 18.68,46.84 21.08,44.44 23.38,44.44 28.53,39.29 28.53,33.01 33.78,27.76 v1(33.78,16.78)
ESP_BOOT: length 17
  Top Layer w0.4: Q4.3 v1(38.64,36.97) ; U5.25 38.64,23.26 v1(38.64,24.83)
  Bottom Layer w0.4: v1(38.64,36.97) v1(38.64,24.83)
ESP_RST: length 41.3
  Top Layer w0.4: Q5.3 35.55,34.79 v1(35.55,33.75) ; U5.3 v1(43.31,9.18)
  Bottom Layer w0.4: v1(43.31,9.18) 35.62,16.87 35.62,33.69 v1(35.55,33.75)
M_EN_O: length 76.9
  Top Layer w0.4: P10.1 97.43,40.91 98.96,42.43 98.96,49.38 97.18,51.16 P6.1 97.43,54.11 99.11,55.79 99.11,65.66 97.43,67.34 P14.1 ; P10.1 P7.1 ; P10.1 97.18,38.41 98.91,36.68 98.91,29.17 97.43,27.7 P13.1 ; U4.4 70.56,36.43 v1(71.52,37.38)
  Bottom Layer w0.4: v1(71.52,37.38) 75.49,41.35 84.94,41.35 85.38,40.91 P7.1
M_EN_O2: length 23.2
  Top Layer w0.4: U12.4 66.42,46.92 68.77,49.27 68.77,65.57 H1.8
MA_DIR: length 27.8
  Top Layer w0.4: v1(61.93,30.75) 59.69,28.51 59.69,25.4 57.44,23.15 U5.14 ; U11.2 71.27,40.99 R40.1 71.06,40.95 v1(69.33,39.22)
  Bottom Layer w0.4: v1(69.33,39.22) 61.93,31.83 v1(61.93,30.75)
MA_STEP: length 17.1
  Top Layer w0.4: U6.3 63.67,30.76 61.07,28.15 61.07,24.79 58.16,21.88 U5.13
MB_DIR: length 24.2
  Top Layer w0.4: v1(53.77,39.27) 53.84,39.34 R39.1 53.87,40.99 U10.2 ; U5.24 41.31,26.3 v1(42.14,27.13)
  Bottom Layer w0.4: v1(42.14,27.13) 53.77,38.76 v1(53.77,39.27)
MB_STEP: length 28.5
  Top Layer w0.4: U5.23 42.58,25.58 43.98,26.98 56.73,26.98 61.78,32.03 U6.2
MOTOR_EN: length 40.7
  Top Layer w0.4: v1(45.04,22.18) 40.93,18.07 U5.29 ; U12.2 65.47,40.99 R41.1 65.43,40.62 65.65,40.39 65.65,38 65.04,37.38 U4.2 60.86,37.38 v1(60.76,37.28)
  Bottom Layer w0.4: v1(60.76,37.28) 60.15,37.28 v1(45.04,22.18)
MX_DIR: length 27.9
  Top Layer w0.4: v1(60.66,21.98) 58.01,19.34 U5.11 ; U8.2 59.67,40.99 59.64,40.95 59.64,35.24 v1(60.66,34.22)
  Bottom Layer w0.4: v1(60.66,34.22) v1(60.66,21.98)
MX_STEP: length 17
  Top Layer w0.4: U5.12 57.96,20.61 62.03,24.69 62.03,27.85 63.68,29.49 U6.4
MY_DIR: length 17.6
  Top Layer w0.4: U6.6 64.76,26.95 64.11,26.31 64.11,22.99 57.92,16.8 U5.9
MY_STEP: length 17.8
  Top Layer w0.4: U5.10 58.17,18.07 63.45,23.35 63.45,27.07 64.6,28.22 U6.5
MZ_DIR: length 15.6
  Top Layer w0.4: U5.7 57.51,14.26 63.16,19.91 R30.1 66.73,21.03 U7.2
MZ_STEP: length 17.1
  Top Layer w0.4: U6.7 65.43,25.68 64.83,25.08 64.83,22.69 57.67,15.53 U5.8
PROBE: length 74.8
  Top Layer w0.4: v1(68.41,71.96) 68.42,71.96 R24.1 ; U5.26 37.3,21.88 36.59,22.59 36.59,24.43 40.4,28.25 v1(52.43,28.25)
  Bottom Layer w0.4: v1(52.43,28.25) 53.1,28.25 63.56,38.71 63.56,67.12 v1(68.41,71.96)
PWM: length 40.6
  Top Layer w0.4: v1(51.36,22.12) 51.47,22.24 U5.16 ; v1(35.5,8.06) 34.19,9.38 34.19,11.39 33.18,12.39 R36.1 31.54,13.94 28.99,16.49 U9.2
  Bottom Layer w0.4: v1(35.5,8.06) 43.73,8.06 44.73,9.07 44.73,15.5 v1(51.36,22.12)
PWM_5V: length 8.5
  Top Layer w0.4: U9.4 26.25,17.44 26.54,17.15 26.54,14.13 R38.2 25.71,14.07 R37.1
PWM_OUT: length 15.3
  Top Layer w0.4: R38.1 27.69,12.9 Q3.3 24.67,11.51 23.57,10.41 R34.1 22.62,4.3 24.06,2.86 P15.2
REST: length 44.2
  Top Layer w0.4: R23.1 18.92,48.4 21.47,45.85 v1(22,45.85) ; v1(35.05,15.66) 35.18,15.53 U5.31
  Bottom Layer w0.4: v1(22,45.85) 23.48,45.85 34.65,34.68 34.65,16.07 v1(35.05,15.66)
RX2: length 10.9
  Top Layer w0.4: R49.1 26.16,22.42 28.08,20.51 32.98,20.51 R31.2
RXD: length 33.8
  Top Layer w0.4: D9.2 22.29,28.03 v1(22.76,27.56) ; R47.1 29.45,24.34 31.03,22.76 32.79,22.76 R29.2 31.53,21.49 v1(31.03,21.49) ; U5.34 37.23,11.72 v1(30.97,17.97)
  Bottom Layer w0.4: v1(31.03,21.49) 30.97,21.44 v1(30.97,17.97) ; v1(22.76,27.56) 24.5,25.82 v1(24.5,24.34)
RXD2: length 4
  Top Layer w0.4: U5.27 34.77,20.61 R31.1
SW: length 50.1
  Top Layer w0.4: v1(38.17,52.55) R14.2 ; U5.36 39.93,9.18 41.74,10.99 v1(41.74,11.95)
  Bottom Layer w0.4: v1(38.17,52.55) 38.17,51.02 35.97,48.82 35.97,44.29 37.76,42.5 37.76,16.24 41.74,12.26 v1(41.74,11.95)
TX2: length 11.3
  Top Layer w0.4: R44.2 23.53,18.58 24.91,19.96 31.6,19.96 33.03,18.53 R32.2
TXD: length 31.8
  Top Layer w0.4: v1(26.18,18.89) 28.02,18.89 36.46,10.45 U5.35 ; R46.1 24.41,20.5 v1(24.45,20.47) ; D11.1 20.09,27.94 v1(20.11,27.91)
  Bottom Layer w0.4: v1(26.18,18.89) 26.03,18.89 v1(24.45,20.47) 20.11,24.8 v1(20.11,27.91)
TXD2: length 4.3
  Top Layer w0.4: R32.1 35.49,19.34 U5.28
USB_DM: length 7.1
  Top Layer w0.4: U14.3 17.84,38.41 16.45,39.8 P16.2
USB_DP: length 9.3
  Top Layer w0.4: U14.1 17.6,40.31 16.92,41 11.25,41 P16.3
VUSB: length 14.4
  Top Layer w0.4: 18.01,34.12 19.85,35.96 19.85,38.9 20.3,39.36 U14.5
  Top Layer w0.6: D10.2 17.81,34.12 14.63,37.3 P16.1
X_DIR_O: length 43.3
  Top Layer w0.4: v1(91.77,59.18) 91.78,59.19 P6.3 ; U8.4 60.62,46.23 62.34,47.94 v1(66.22,47.94) ; v1(69.33,47.94) 80.75,47.94 89.06,56.25 v1(89.06,58.19)
  Bottom Layer w0.4: v1(89.06,58.19) 90.05,59.18 v1(91.77,59.18) ; v1(66.22,47.94) v1(69.33,47.94)
X_LIMT: length 28.7
  Top Layer w0.4: U5.6 58.38,12.99 61.01,15.62 72.74,15.62 77.92,20.8 R2.2
X_LIMT_I: length 10
  Top Layer w0.4: P2.1 85.87,19.69 85.45,19.28 C1.2 84.61,19.22 R1.1 R2.1
X_STEP_O: length 41.7
  Top Layer w0.4: P6.2 92.52,56.65 77.89,42.03 77.89,32.28 75.1,29.49 U6.13
Y_DIR_O: length 37.9
  Top Layer w0.4: v1(77.13,29.19) 78.81,30.87 78.81,39.74 85.05,45.99 P7.3 97.29,45.99 ; U6.11 72.47,26.94 v1(74.48,26.94)
  Bottom Layer w0.4: v1(74.48,26.94) 74.88,26.94 v1(77.13,29.19)
Y_LIMT: length 27.1
  Top Layer w0.4: R5.2 78.47,13.82 77.55,14.74 61.15,14.74 58.13,11.72 U5.5
Y_LIMT_I: length 10.2
  Top Layer w0.4: P3.1 89.72,13.06 88.89,12.23 R4.1 R5.1
Y_STEP_O: length 35
  Top Layer w0.4: 97.18,43.45 86.08,43.45 83.55,40.92 83.55,34.22 77.56,28.22 U6.12
Z_DIR_O: length 34.3
  Top Layer w0.4: v1(94.88,25.72) 80.8,25.72 75.16,20.08 U7.4
  Bottom Layer w0.4: P13.3 96.93,32.78 94.88,30.72 v1(94.88,25.72)
Z_LIMT: length 28
  Top Layer w0.4: U5.4 57.89,10.45 59.55,12.1 75.6,12.1 80.01,7.7 R9.2
Z_LIMT_I: length 10
  Top Layer w0.4: R9.1 81.93,6.11 81.98,6.17 C12.2 85.45,6.17 85.71,6.43 P5.1
Z_STEP_O: length 26.6
  Top Layer w0.4: P13.2 94.5,30.24 90.95,26.69 79.63,26.69 78.62,25.68 U6.10
$9N72390: length 12.6
  Top Layer w0.8: L1.2 44.71,62.3 D2.2
  Top Layer w1: U1.2 52.34,59.38 L1.2
$9N72392: length 3.8
  Top Layer w0.4: R7.1 55.19,54.66 54.52,55.33 U1.4
$9N72730: length 1.8
  Top Layer w0.4: R3.1 21.12,64.15 D3.1
$9N85928: length 3.6
  Top Layer w0.4: U13.4 23.19,41.49 C25.1
$9N85949: length 4
  Top Layer w0.4: U14.6 21.44,40.22 U13.5
$9N85958: length 4.2
  Top Layer w0.4: U13.6 22.54,38.95 22.01,38.41 U14.4
$9N85962: length 10.9
  Top Layer w0.4: U13.7 26.83,37.68 30.04,34.47 30.04,32.94 ; Y1.2 30.36,32.85 C26.1
$9N85965: length 7
  Top Layer w0.4: C27.1 24.78,32.87 Y1.1 25.35,33.43 25.35,36.41
$9N86544: length 13.5
  Top Layer w0.4: D9.1 22.35,34.12 v1(23.57,35.33) ; v1(27.19,38.95) 27.19,43.55 26.71,44.03 U13.2
  Bottom Layer w0.4: v1(27.19,38.95) v1(23.57,35.33)
$9N86546: length 19.1
  Top Layer w0.4: v1(22.75,36.92) 22.75,36.68 20.19,34.12 D11.2 ; U13.3 23.6,42.76 v1(23.57,42.73) 23.57,46.45 24.91,47.79 R42.1
  Bottom Layer w0.4: v1(23.57,42.73) 22.75,41.91 v1(22.75,36.92)
$9N86982: length 6.8
  Top Layer w0.4: U13.13 33.72,41.49 R48.1 35.1,40.72 Q4.2
$9N86987: length 10.1
  Top Layer w0.4: 34.45,42.78 34.43,42.76 U13.14 ; Q5.2 32.95,38.44 v1(32.95,39.87)
  Bottom Layer w0.4: v1(32.95,39.87) v1(32.95,42.78)
$9N87254: length 17.5
  Top Layer w0.4: D12.2 14.12,20.75 13.94,20.92 P17.3 ; v1(11.7,24.24) 13.29,24.24 R45.1
  Bottom Layer w0.4: v1(11.7,24.24) 11.59,24.14 v1(11.59,20.93)
$9N87257: length 13
  Top Layer w0.4: D13.1 14.27,22.99 13.94,22.66 7.77,22.66 6.97,23.46 P17.2
$9N89334: length 1.9
  Top Layer w0.4: Q4.1 36.64,42.18 R43.2
$9N89338: length 3
  Top Layer w0.4: Q5.1 36.35,37.26 R48.2
$9N98710: length 30.1
  Top Layer w0.4: K1.3 17.31,50.59 R16.2 17.31,48.46 R23.2 ; K1.3 15.32,49.09 C15.2 ; K1.3 K1.4 13.4,60.91 7.77,60.91 4.04,57.18 P12.1
$9N100484: length 12.1
  Top Layer w0.4: R19.2 73.19,73.75 71.81,73.75 71.81,75.7 C16.2 71.62,76.68 71.67,76.73 P9.2
$9N100840: length 1.8
  Top Layer w0.4: D7.1 21.1,58.39 R10.1
$9N100955: length 1.8
  Top Layer w0.4: R6.1 21.1,61.14 D5.1
$9N125401: length 7
  Top Layer w0.4: v1(24.24,12.41) 22.84,12.41 R37.2 20.69,12.47 R35.1 ; Q3.1 25.35,10.38 v1(25.06,10.68)
  Bottom Layer w0.4: v1(25.06,10.68) 25.06,11.59 v1(24.24,12.41)
$9N127736: length 28.5
  Top Layer w0.4: R18.2 20.32,54.18 17.66,56.83 17.66,62.59 14.77,65.48 10.61,65.48 C14.2 4.12,65.39 3.97,65.55 P11.1
$9N129587: length 5
  Top Layer w0.4: D13.2 20.78,22.99 R49.2 R47.2
$9N129623: length 5
  Top Layer w0.4: 18.38,20.75 21.11,20.75 R46.2 21.35,18.58
$9N130300: length 1.9
  Top Layer w0.4: D8.1 25.02,76.42 R11.2
$9N130301: length 22.7
  Top Layer w0.4: 31.44,83.05 27.51,83.05 25.02,80.56 D8.2
  Top Layer w1.5: Q1.2 30.31,68.89 C8.2 30.31,80.73 31.44,81.85 31.44,83.05
$9N130305: length 16.2
  Top Layer w0.4: v1(36.99,58.82) 36.99,58.05 Q2.2 ; DZ1.2 41.25,66.36 R13.2 38.04,66.57 Q1.1 36.99,66.52 v1(36.99,64.99)
  Bottom Layer w0.4: v1(36.99,58.82) v1(36.99,64.99)
$9N130308: length 3.8
  Top Layer w0.4: R12.1 34.05,57.57 33.76,57.29 Q2.3
$9N130311: length 1.9
  Top Layer w0.4: Q2.1 36.39,55.44 R14.1
$9N133119: length 2.5
  Top Layer w0.6: H1.4 H1.3

## Copper pours and planes (outline as drawn; the poured copper is in the pictures)
GND on Top Layer: -2.02,87.07 101.81,87.07 101.81,-1.21 -2.02,-1.21
GND on Bottom Layer: -1.16,86.92 100.95,86.92 100.95,-1.11 -1.16,-1.11

Small or netless copper shapes (teardrops, artwork), in the pictures only: 423 on Top Layer, 89 on Bottom Layer

## Text on the board
Top Silkscreen Layer: 5V | 12V_DIV | CLK_Y2 | DIR_Y2 | EN | LIMIT | CLK_X | CLK_A | CLK_Y1 | DIR_Y1 | DIR_X | CLK_Z | DIR_A | DIR_Z | GND | TX | RX | X_LIMIT | Y_LIMIT | Z_LIMIT | 24V | PWM | CHANGE | RST | Probe | 24V+ | B-MOTOR
